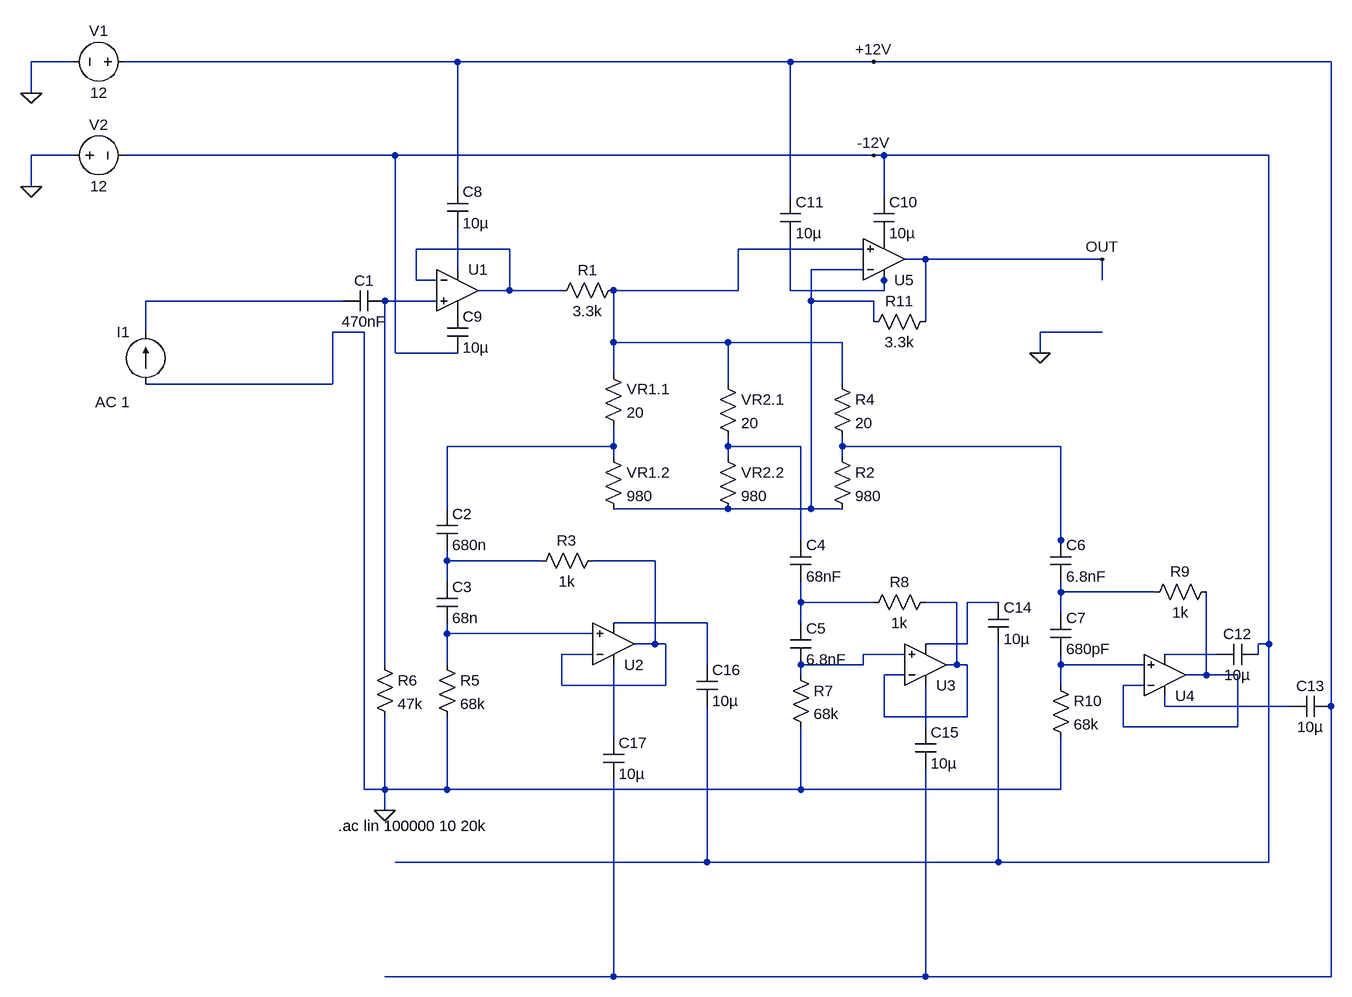
[diagram p0: schematic eqsim.asc]
eqsim.asc, the LTspice schematic file:
Version 4.1
SHEET 1 1576 1080
WIRE -368 -336 -432 -336
WIRE 224 -336 -288 -336
WIRE 736 -336 224 -336
WIRE 864 -336 736 -336
WIRE 1568 -336 864 -336
WIRE -432 -288 -432 -336
WIRE -368 -192 -432 -192
WIRE 128 -192 -288 -192
WIRE 864 -192 128 -192
WIRE 880 -192 864 -192
WIRE 1472 -192 880 -192
WIRE -432 -144 -432 -192
WIRE 224 -144 224 -336
WIRE 736 -128 736 -336
WIRE 880 -128 880 -192
WIRE 304 -48 160 -48
WIRE 848 -48 656 -48
WIRE 944 -32 912 -32
WIRE 1216 -32 944 -32
WIRE 224 -16 224 -80
WIRE 848 -16 768 -16
WIRE 160 0 160 -48
WIRE 192 0 160 0
WIRE 880 0 880 -16
WIRE 1216 0 1216 -32
WIRE 304 16 304 -48
WIRE 304 16 256 16
WIRE 384 16 304 16
WIRE 656 16 656 -48
WIRE 656 16 464 16
WIRE 736 16 736 -64
WIRE 880 16 880 0
WIRE 880 16 736 16
WIRE 48 32 -256 32
WIRE 192 32 112 32
WIRE 768 32 768 -16
WIRE 864 32 768 32
WIRE 864 64 864 32
WIRE 944 64 944 -32
WIRE -256 80 -256 32
WIRE 80 80 32 80
WIRE 1216 80 1120 80
WIRE 464 96 464 16
WIRE 640 96 464 96
WIRE 816 96 640 96
WIRE 128 112 128 -192
WIRE 224 112 128 112
WIRE 1120 112 1120 80
WIRE 464 144 464 96
WIRE 32 160 32 80
WIRE 32 160 -256 160
WIRE 640 160 640 96
WIRE 816 160 816 96
WIRE 464 256 464 224
WIRE 464 256 208 256
WIRE 640 256 640 240
WIRE 752 256 640 256
WIRE 816 256 816 240
WIRE 1152 256 816 256
WIRE 464 272 464 256
WIRE 640 272 640 256
WIRE 816 272 816 256
WIRE 208 352 208 256
WIRE 640 352 464 352
WIRE 768 352 768 32
WIRE 768 352 640 352
WIRE 816 352 768 352
WIRE 752 400 752 256
WIRE 1152 400 1152 256
WIRE 1152 416 1152 400
WIRE 208 432 208 416
WIRE 352 432 208 432
WIRE 528 432 432 432
WIRE 208 464 208 432
WIRE 1152 480 1152 464
WIRE 1296 480 1152 480
WIRE 752 496 752 464
WIRE 864 496 752 496
WIRE 992 496 944 496
WIRE 1056 496 1008 496
WIRE 1152 512 1152 480
WIRE 608 528 464 528
WIRE 752 528 752 496
WIRE 208 544 208 528
WIRE 432 544 208 544
WIRE 528 560 528 432
WIRE 528 560 496 560
WIRE 544 560 528 560
WIRE 1008 560 1008 496
WIRE 1008 560 944 560
WIRE 1472 560 1472 -192
WIRE 1472 560 1456 560
WIRE 432 576 384 576
WIRE 912 576 848 576
WIRE 1392 576 1312 576
WIRE 1456 576 1456 560
WIRE 112 592 112 32
WIRE 208 592 208 544
WIRE 608 592 608 528
WIRE 848 592 848 576
WIRE 848 592 752 592
WIRE 992 592 992 496
WIRE 992 592 976 592
WIRE 1008 592 992 592
WIRE 1152 592 1152 576
WIRE 1280 592 1152 592
WIRE 752 608 752 592
WIRE 912 608 880 608
WIRE 1376 608 1376 480
WIRE 1376 608 1344 608
WIRE 1424 608 1376 608
WIRE 384 624 384 576
WIRE 544 624 544 560
WIRE 544 624 384 624
WIRE 1152 624 1152 592
WIRE 1280 624 1248 624
WIRE 1312 656 1312 640
WIRE 1504 656 1312 656
WIRE 1568 656 1568 -336
WIRE 880 672 880 608
WIRE 1008 672 1008 592
WIRE 1008 672 880 672
WIRE 944 688 944 624
WIRE 1248 688 1248 624
WIRE 1424 688 1424 608
WIRE 1424 688 1248 688
WIRE 464 704 464 592
WIRE 80 784 80 80
WIRE 112 784 112 672
WIRE 112 784 80 784
WIRE 208 784 208 672
WIRE 208 784 112 784
WIRE 752 784 752 688
WIRE 752 784 208 784
WIRE 1152 784 1152 704
WIRE 1152 784 752 784
WIRE 112 816 112 784
WIRE 608 896 608 656
WIRE 608 896 128 896
WIRE 1056 896 1056 560
WIRE 1056 896 608 896
WIRE 1472 896 1472 560
WIRE 1472 896 1056 896
WIRE 464 1072 464 768
WIRE 464 1072 112 1072
WIRE 944 1072 944 752
WIRE 944 1072 464 1072
WIRE 1568 1072 1568 656
WIRE 1568 1072 944 1072
FLAG 112 816 0
FLAG 1120 112 0
FLAG 1216 -32 OUT
FLAG 864 -336 +12V
FLAG -432 -288 0
FLAG -432 -144 0
FLAG 864 -192 -12V
SYMBOL cap 112 16 R90
WINDOW 0 0 32 VBottom 2
WINDOW 3 32 32 VTop 2
SYMATTR InstName C1
SYMATTR Value 470nF
SYMBOL OpAmps\\UniversalOpAmp1 224 16 R0
SYMATTR InstName U1
SYMBOL res 480 0 R90
WINDOW 0 0 56 VBottom 2
WINDOW 3 32 56 VTop 2
SYMATTR InstName R1
SYMATTR Value 3.3k
SYMBOL res 448 128 R0
SYMATTR InstName VR1.1
SYMATTR Value 20
SYMBOL res 448 256 R0
SYMATTR InstName VR1.2
SYMATTR Value 980
SYMBOL cap 192 352 R0
SYMATTR InstName C2
SYMATTR Value 680n
SYMBOL cap 192 464 R0
SYMATTR InstName C3
SYMATTR Value 68n
SYMBOL res 448 416 R90
WINDOW 0 0 56 VBottom 2
WINDOW 3 32 56 VTop 2
SYMATTR InstName R3
SYMATTR Value 1k
SYMBOL res 624 256 R0
SYMATTR InstName VR2.2
SYMATTR Value 980
SYMBOL res 624 144 R0
SYMATTR InstName VR2.1
SYMATTR Value 20
SYMBOL res 800 256 R0
SYMATTR InstName R2
SYMATTR Value 980
SYMBOL res 800 144 R0
SYMATTR InstName R4
SYMATTR Value 20
SYMBOL OpAmps\\UniversalOpAmp1 464 560 M180
SYMATTR InstName U2
SYMBOL res 192 576 R0
SYMATTR InstName R5
SYMATTR Value 68k
SYMBOL res 96 576 R0
SYMATTR InstName R6
SYMATTR Value 47k
SYMBOL cap 736 400 R0
SYMATTR InstName C4
SYMATTR Value 68nF
SYMBOL cap 736 528 R0
SYMATTR InstName C5
SYMATTR Value 6.8nF
SYMBOL res 736 592 R0
SYMATTR InstName R7
SYMATTR Value 68k
SYMBOL res 960 480 R90
WINDOW 0 0 56 VBottom 2
WINDOW 3 32 56 VTop 2
SYMATTR InstName R8
SYMATTR Value 1k
SYMBOL OpAmps\\UniversalOpAmp1 944 592 M180
SYMATTR InstName U3
SYMBOL cap 1136 400 R0
SYMATTR InstName C6
SYMATTR Value 6.8nF
SYMBOL cap 1136 512 R0
SYMATTR InstName C7
SYMATTR Value 680pF
SYMBOL res 1392 464 R90
WINDOW 0 0 56 VBottom 2
WINDOW 3 32 56 VTop 2
SYMATTR InstName R9
SYMATTR Value 1k
SYMBOL res 1136 608 R0
SYMATTR InstName R10
SYMATTR Value 68k
SYMBOL OpAmps\\UniversalOpAmp1 1312 608 M180
SYMATTR InstName U4
SYMBOL OpAmps\\UniversalOpAmp1 880 -32 M180
SYMATTR InstName U5
SYMBOL res 848 80 R270
WINDOW 0 32 56 VTop 2
WINDOW 3 0 56 VBottom 2
SYMATTR InstName R11
SYMATTR Value 3.3k
SYMBOL current -256 160 R180
WINDOW 0 24 80 Left 2
WINDOW 3 24 0 Left 2
WINDOW 123 24 -28 Left 2
WINDOW 39 0 0 Left 0
SYMATTR InstName I1
SYMATTR Value ""
SYMATTR Value2 AC 1
SYMBOL cap 208 -144 R0
SYMATTR InstName C8
SYMATTR Value 10µ
SYMBOL cap 208 48 R0
SYMATTR InstName C9
SYMATTR Value 10µ
SYMBOL voltage -272 -336 R90
WINDOW 0 -32 56 VBottom 2
WINDOW 3 32 56 VTop 2
SYMATTR InstName V1
SYMATTR Value 12
SYMBOL voltage -384 -192 R270
WINDOW 0 32 56 VTop 2
WINDOW 3 -32 56 VBottom 2
SYMATTR InstName V2
SYMATTR Value 12
SYMBOL cap 864 -128 R0
SYMATTR InstName C10
SYMATTR Value 10µ
SYMBOL cap 720 -128 R0
SYMATTR InstName C11
SYMATTR Value 10µ
SYMBOL cap 1456 560 R90
WINDOW 0 0 32 VBottom 2
WINDOW 3 32 32 VTop 2
SYMATTR InstName C12
SYMATTR Value 10µ
SYMBOL cap 1504 672 R270
WINDOW 0 32 32 VTop 2
WINDOW 3 0 32 VBottom 2
SYMATTR InstName C13
SYMATTR Value 10µ
SYMBOL cap 1040 496 R0
SYMATTR InstName C14
SYMATTR Value 10µ
SYMBOL cap 928 688 R0
SYMATTR InstName C15
SYMATTR Value 10µ
SYMBOL cap 592 592 R0
SYMATTR InstName C16
SYMATTR Value 10µ
SYMBOL cap 448 704 R0
SYMATTR InstName C17
SYMATTR Value 10µ
TEXT 40 840 Left 2 !.ac lin 100000 10 20k

The netlist it stands for:
* eqsim.asc
C1 N007 N006 470nF
X§U1 N007 N001 N003 P001 N001 level1 Avol=1Meg GBW=10Meg Vos=0 En=0 Enk=0 In=0 Ink=0 Rin=500Meg  ; pins In+ In- V+ V- OUT
R1 N002 N001 3.3k
R§VR1.1 N002 N008 20
R§VR1.2 N008 N004 980
C2 N008 N011 680n
C3 N011 N018 68n
R3 N012 N011 1k
R§VR2.2 N009 N004 980
R§VR2.1 N002 N009 20
R2 N010 N004 980
R4 N002 N010 20
X§U2 N018 N012 N025 N017 N012 level1 Avol=1Meg GBW=10Meg Vos=0 En=0 Enk=0 In=0 Ink=0 Rin=500Meg  ; pins In+ In- V+ V- OUT
R5 N018 0 68k
R6 N007 0 47k
C4 N009 N014 68nF
C5 N014 N019 6.8nF
R7 N019 0 68k
R8 N015 N014 1k
X§U3 N019 N015 N024 N016 N015 level1 Avol=1Meg GBW=10Meg Vos=0 En=0 Enk=0 In=0 Ink=0 Rin=500Meg  ; pins In+ In- V+ V- OUT
C6 N010 N013 6.8nF
C7 N013 N021 680pF
R9 N022 N013 1k
R10 N021 0 68k
X§U4 N021 N022 N023 N020 N022 level1 Avol=1Meg GBW=10Meg Vos=0 En=0 Enk=0 In=0 Ink=0 Rin=500Meg  ; pins In+ In- V+ V- OUT
X§U5 N002 N004 N005 P002 OUT level1 Avol=1Meg GBW=10Meg Vos=0 En=0 Enk=0 In=0 Ink=0 Rin=500Meg  ; pins In+ In- V+ V- OUT
R11 N004 OUT 3.3k
I1 0 N006 AC 1
C8 +12V N003 10µ
C9 P001 -12V 10µ
V1 +12V 0 12
V2 0 -12V 12
C10 -12V P002 10µ
C11 +12V N005 10µ
C12 -12V N020 10µ
C13 N023 +12V 10µ
C14 N016 -12V 10µ
C15 N024 +12V 10µ
C16 N017 -12V 10µ
C17 N025 +12V 10µ
.ac lin 100000 10 20k
.lib UniversalOpAmp1.lib
.backanno
.end